# Altium schematic sheet schematic.SchDoc
size A4
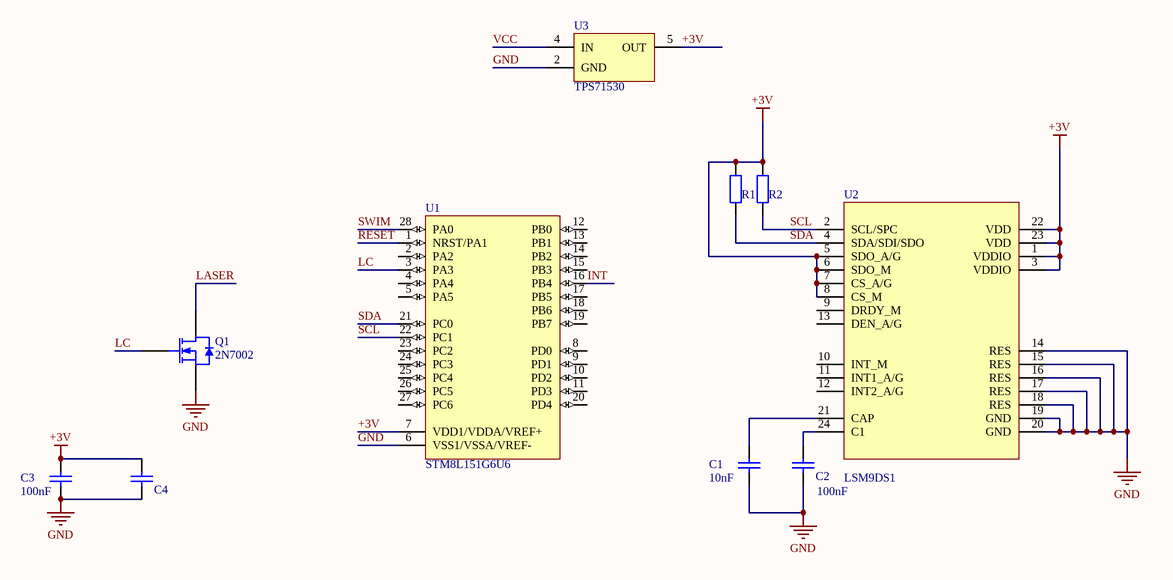
[diagram p0: schematic.SchDoc]

## Parts
C1  Номинал: 10nF  [CAPC1608N]  (hidden comment: C0603)
C2  Номинал: 100nF  [CAPC1005N]  (hidden comment: C0603)
C3  Номинал: 100nF  [CAPC1005N]  (hidden comment: C0603)
C4  C0603  [CAPC1608N]  (value not drawn)
Q1  2N7002  [SOT23-3L]
R1  R0603  [RESC1005N]  (value not drawn)
R2  R0603  [RESC1005N]  (value not drawn)
U1  STM8L151G6U6  [UFQFPN28_V]
U2  LSM9DS1  [QFN43P350X300X100-24M]
U3  TPS71530  [TSOP65P210X50-5N]

## Nets
+3V: C3.2 C4.2 R1.1 R2.1 U1.7(VDD1/VDDA/VREF+) U2.1(VDDIO) U2.3(VDDIO) U2.5(SDO_A/G) U2.6(SDO_M) U2.7(CS_A/G) U2.8(CS_M) U2.22(VDD) U2.23(VDD) U3.5(OUT)
GND: C1.1 C2.1 C3.1 C4.1 Q1.2(S) U1.6(VSS1/VSSA/VREF-) U2.14(RES) U2.15(RES) U2.16(RES) U2.17(RES) U2.18(RES) U2.19(GND) U2.20(GND) U3.2(GND)
INT: U1.16(PB4)
LASER: Q1.3(D)
LC: Q1.1(G) U1.3(PA3)
RESET: U1.1(NRST/PA1)
SCL: R2.2 U1.22(PC1) U2.2(SCL/SPC)
SDA: R1.2 U1.21(PC0) U2.4(SDA/SDI/SDO)
SWIM: U1.28(PA0)
VCC: U3.4(IN)
NetC1_2: C1.2 U2.21(CAP)
NetC2_2: C2.2 U2.24(C1)

Not connected (* = marked no-connect by the designer): U1 2(PA2) 4(PA4) 5(PA5) 8(PD0) 9(PD1) 10(PD2) 11(PD3) 12(PB0) 13(PB1) 14(PB2) 15(PB3) 17(PB5) 18(PB6) 19(PB7) 20(PD4) 23(PC2) 24(PC3) 25(PC4) 26(PC5) 27(PC6); U2 9(DRDY_M) 10(INT_M) 11(INT1_A/G) 12(INT2_A/G) 13(DEN_A/G)

## Library data of the parts
C1-C3 = C0603: Конденсатор; Корпус: 0805
C4 = C0603: Конденсатор; Корпус: 0805; Номинал: 100nF
Q1 = 2N7002: N-channel Enhancement Mode Field-effect Transistor; Published: 17-Sep-2003; LatestRevisionDate: 12-Dec-2006; LatestRevisionNote: IPC-7351 Footprint Added.; DatasheetVersion: 27-Jul-2000; PackageVersion: May-1999; PackageReference: SOT23; Publisher: Altium Limited; PackageDescription: 3-Pin SOT-23 Package 0.95 mm Pitch, 2.3 mm Lead Span; ComponentLink1Description: Manufacturer Link; ComponentLink1URL: http://www.semiconductors.philips.com/; ComponentLink2Description: Datasheet; ComponentLink2URL: http://www.semiconductors.philips.com/acrobat/datasheets/2N7002_4.pdf
R1 R2 = R0603: Резистор; Корпус: 0805; Номинал: 10k
U1 = STM8L151G6U6: STM8L ARM-based EnergyLite 8-bit MCU, 32 kB Flash, 2 kB Internal RAM, -40 to +85°C Temperature, 28-pin UFQFPN, Tray; PackageVersion: 26/04/2010; PackageReference: UFQFPN28; PackageDescription: 28-Pin Ultra Thin Fine Pitch Quad Flat No-Lead, 4 x 4 x 0.55 mm Body, 0.5 mm Pitch; ComponentLink1Description: Manufacturer URL; ComponentLink1URL: http://www.st.com/; ComponentLink2Description: STM8L151/152,x4,x6 Datasheet; ComponentLink2URL: http://www.st.com/internet/com/TECHNICAL_RESOURCES/TECHNICAL_LITERATURE/DATASHEET/CD00240181.pdf; ComponentLink3Description: STM8L Family Web Page; ComponentLink3URL: http://www.st.com/internet/mcu/subclass/1381.jsp
U2 = LSM9DS1: iNEMO digital compass
U3 = TPS71530: Стабилизатор